# Altium schematic sheet SHIFTER.SchDoc
size B; Organization: Altium Limited; Address1: L3, 12a Rodborough Rd; Address2: Frenchs Forest; Address3: NSW; Address4: Australia 2086; DocumentNumber: 2; SheetNumber: 2; SheetTotal: 4
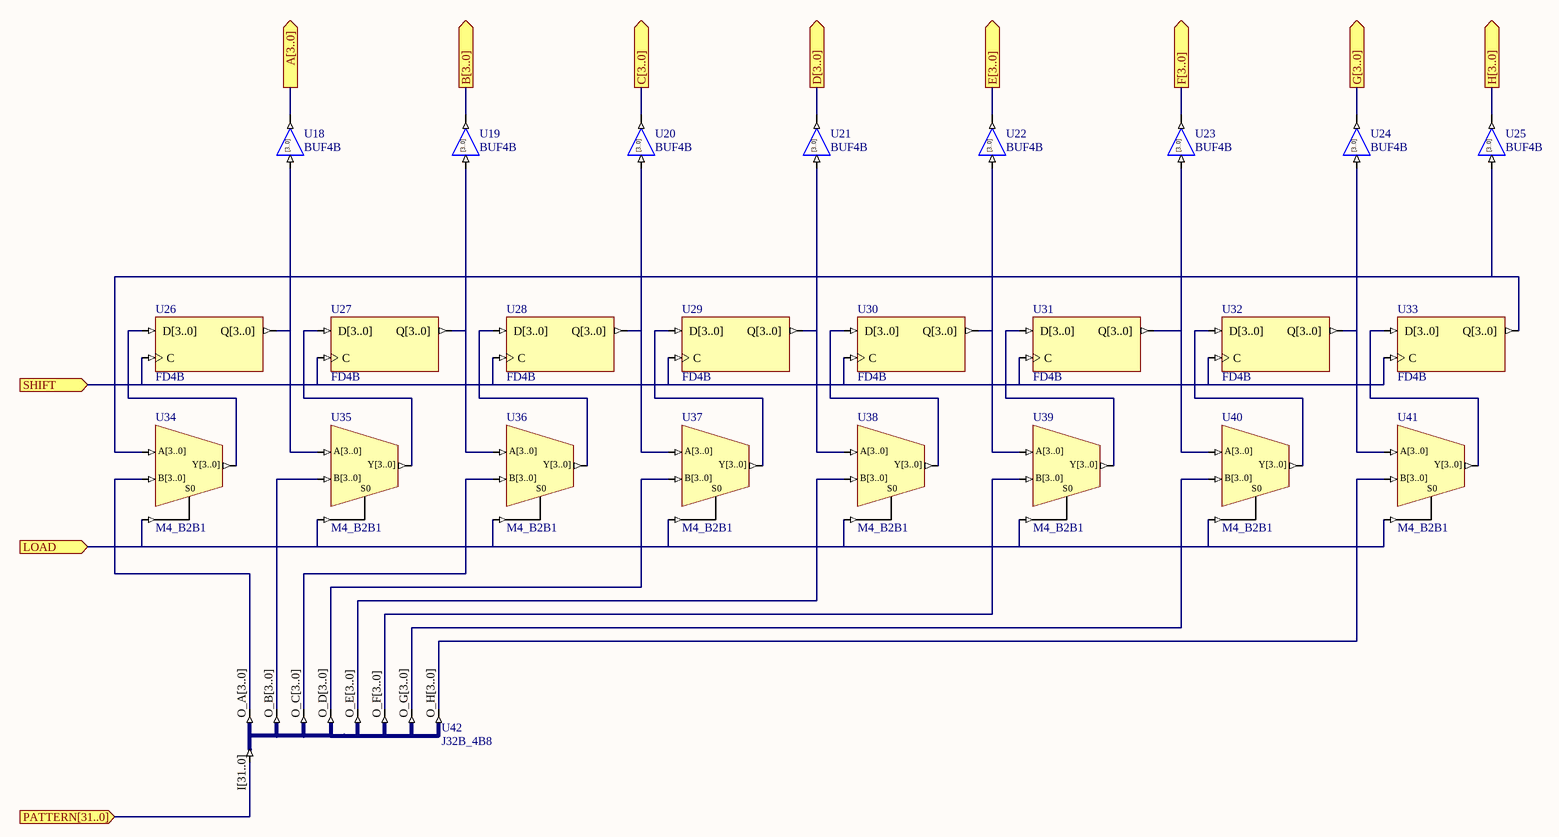
[diagram p0: SHIFTER.SchDoc]

## Parts
U18  BUF4B
U19  BUF4B
U20  BUF4B
U21  BUF4B
U22  BUF4B
U23  BUF4B
U24  BUF4B
U25  BUF4B
U26  FD4B
U27  FD4B
U28  FD4B
U29  FD4B
U30  FD4B
U31  FD4B
U32  FD4B
U33  FD4B
U34  M4_B2B1
U35  M4_B2B1
U36  M4_B2B1
U37  M4_B2B1
U38  M4_B2B1
U39  M4_B2B1
U40  M4_B2B1
U41  M4_B2B1
U42  J32B_4B8

## Ports
A[3..0] (out), B[3..0] (out), C[3..0] (out), D[3..0] (out), E[3..0] (out), F[3..0] (out), G[3..0] (out), H[3..0] (out), LOAD (in), PATTERN[31..0] (in), SHIFT (in)

## Nets
A[3..0]: U18.O[3..0] ; port A[3..0]
B[3..0]: U19.O[3..0] ; port B[3..0]
C[3..0]: U20.O[3..0] ; port C[3..0]
D[3..0]: U21.O[3..0] ; port D[3..0]
E[3..0]: U22.O[3..0] ; port E[3..0]
F[3..0]: U23.O[3..0] ; port F[3..0]
G[3..0]: U24.O[3..0] ; port G[3..0]
H[3..0]: U25.O[3..0] ; port H[3..0]
LOAD: U34.S0 U35.S0 U36.S0 U37.S0 U38.S0 U39.S0 U40.S0 U41.S0 ; port LOAD
PATTERN[31..0]: U42.I[31..0] ; port PATTERN[31..0]
SHIFT: U26.C U27.C U28.C U29.C U30.C U31.C U32.C U33.C ; port SHIFT
NetU18_I[3..0]: U18.I[3..0] U26.Q[3..0] U35.A[3..0]
NetU19_I[3..0]: U19.I[3..0] U27.Q[3..0] U36.A[3..0]
NetU20_I[3..0]: U20.I[3..0] U28.Q[3..0] U37.A[3..0]
NetU21_I[3..0]: U21.I[3..0] U29.Q[3..0] U38.A[3..0]
NetU22_I[3..0]: U22.I[3..0] U30.Q[3..0] U39.A[3..0]
NetU23_I[3..0]: U23.I[3..0] U31.Q[3..0] U40.A[3..0]
NetU24_I[3..0]: U24.I[3..0] U32.Q[3..0] U41.A[3..0]
NetU25_I[3..0]: U25.I[3..0] U33.Q[3..0] U34.A[3..0]
NetU26_D[3..0]: U26.D[3..0] U34.Y[3..0]
NetU27_D[3..0]: U27.D[3..0] U35.Y[3..0]
NetU28_D[3..0]: U28.D[3..0] U36.Y[3..0]
NetU29_D[3..0]: U29.D[3..0] U37.Y[3..0]
NetU30_D[3..0]: U30.D[3..0] U38.Y[3..0]
NetU31_D[3..0]: U31.D[3..0] U39.Y[3..0]
NetU32_D[3..0]: U32.D[3..0] U40.Y[3..0]
NetU33_D[3..0]: U33.D[3..0] U41.Y[3..0]
NetU34_B[3..0]: U34.B[3..0] U42.O_A[3..0]
NetU35_B[3..0]: U35.B[3..0] U42.O_B[3..0]
NetU36_B[3..0]: U36.B[3..0] U42.O_C[3..0]
NetU37_B[3..0]: U37.B[3..0] U42.O_D[3..0]
NetU38_B[3..0]: U38.B[3..0] U42.O_E[3..0]
NetU39_B[3..0]: U39.B[3..0] U42.O_F[3..0]
NetU40_B[3..0]: U40.B[3..0] U42.O_G[3..0]
NetU41_B[3..0]: U41.B[3..0] U42.O_H[3..0]

## Notes on the sheet
- Title
- Size:
- Date:
- B
- Number:
- Time:
- Revision:
- Sheet
- of
- File:
- (in symbol BUF4B) [3..0]

## Library data of the parts
U18-U25 = BUF4B: 4-Bit General Purpose (Non-inverting) Buffer, Bus Version; ArchiveName: GENERIC; VHDLIB_SIM: GENERIC_LIB; Published: 29-Jan-2004; Publisher: Altium Limited; Core Revision: 1.00.00
U26-U33 = FD4B: 4-Bit D-Type Flip-Flop, Bus Version; ArchiveName: GENERIC; VHDLIB_SIM: GENERIC_LIB; Published: 29-Jan-2004; Publisher: Altium Limited; Core Revision: 1.00.00
U34-U41 = M4_B2B1: 2x4-Bit Bus to 1x4-Bit Bus Multiplexer; ArchiveName: GENERIC; VHDLIB_SIM: GENERIC_LIB; Published: 29-Jan-2004; Publisher: Altium Limited; Core Revision: 1.00.00
U42 = J32B_4B8: 1 x 32-Bit input bus to 8 x 4-Bit output bus; ArchiveName: GENERIC; VHDLIB_SIM: GENERIC_LIB; Published: 29-Jan-2004; Publisher: Altium Limited; Core Revision: 1.00.00